# EAGLE design Min_PIC_Trailer (EAGLE 9.6.2)
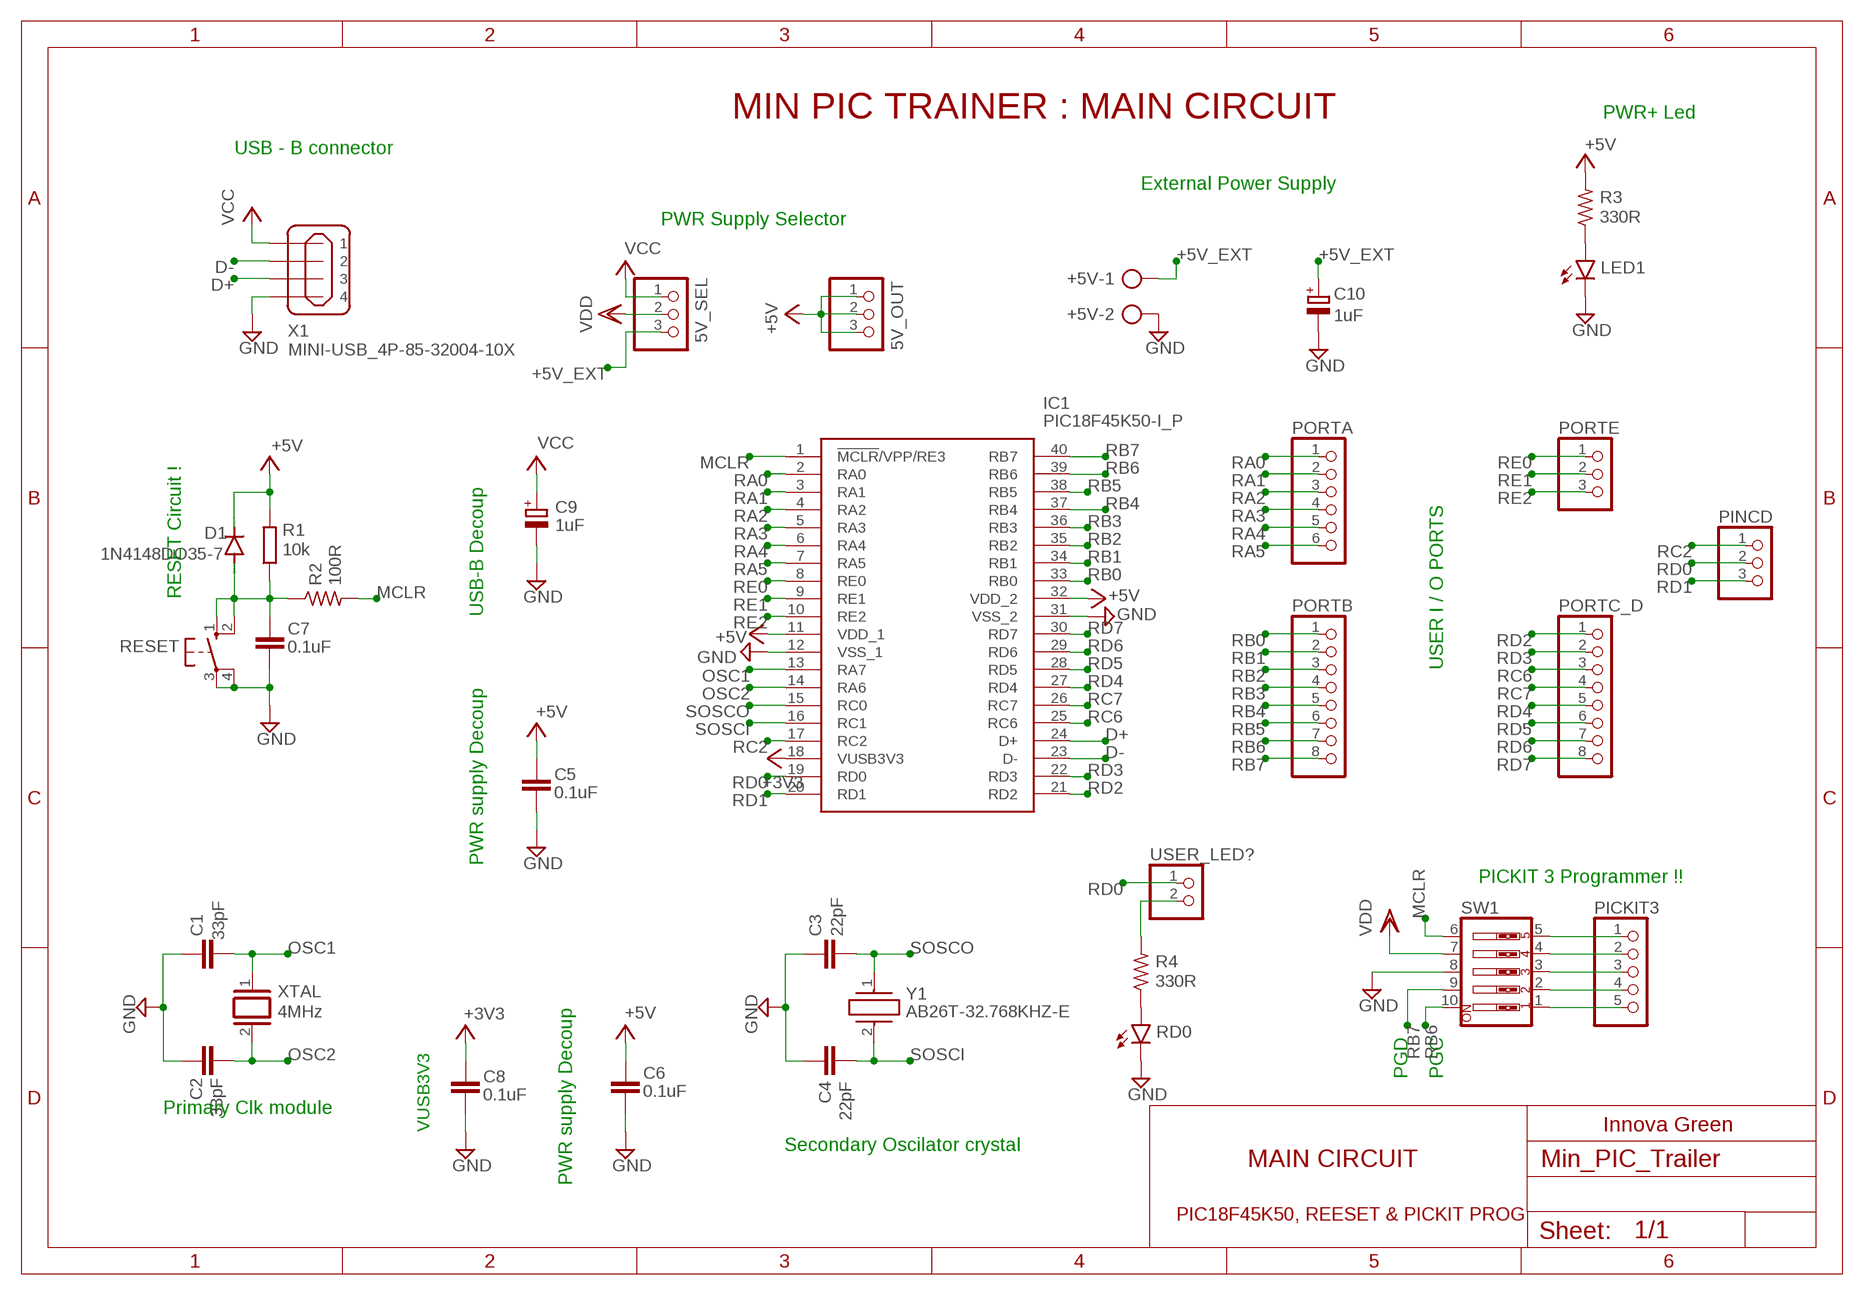
[diagram p0: schematic, sheet 1]

## Parts
5V_OUT  PINHD-1X3  [1X03]
5V_SEL  PINHD-1X3  [1X03]
+5V  AK500/2  [AK500/2]
C1  33pF  C-EUC0805  [C0805]
C2  33pF  C-EUC0805  [C0805]
C3  22pF  C-EUC0805K  [C0805K]
C4  22pF  C-EUC0805K  [C0805K]
C5  0.1uF  C-EUC0805  [C0805]
C6  0.1uF  C-EUC0805  [C0805]
C7  0.1uF  C-EUC0805  [C0805]
C8  0.1uF  C-EUC0805  [C0805]
C9  1uF  CPOL-EUE2.5-6  [E2,5-6]
C10  1uF  CPOL-EUE2.5-6  [E2,5-6]
D1  1N4148DO35-7  [DO35-7]
IC1  PIC18F45K50-I_P  [DIP1543W58P254L5175H635Q40N]
LED1  LEDCHIP-LED0805  [CHIP-LED0805]
PICKIT3  PINHD-1X5/90  [1X05/90]
PINCD  PINHD-1X3  [1X03]
PORTA  PINHD-1X6  [1X06]
PORTB  PINHD-1X8  [1X08]
PORTC_D  PINHD-1X8  [1X08]
PORTE  PINHD-1X3  [1X03]
R1  10k  R-EU_R0805  [R0805]
R2  100R  R-US_R0805W  [R0805W]
R3  330R  R-US_R0805  [R0805]
R4  330R  R-US_R0805  [R0805]
RD0  LEDCHIP-LED0805  [CHIP-LED0805]
RESET  10-XX  [B3F-10XX]
SW1  SW_DIP-5  [EDG-05]
USER_LED?  PINHD-1X2  [1X02]
X1  MINI-USB_4P-85-32004-10X  [85-32004-10X]
XTAL  4MHz  XTAL/S  [QS]
Y1  AB26T-32.768KHZ-E  [AB26T32768KHZE]

## Nets
+3V3: C8.1 IC1.18(VUSB3V3)
+5V: 5V_OUT.1 5V_OUT.2 5V_OUT.3 C5.1 C6.1 D1.C IC1.11(VDD_1) IC1.32(VDD_2) R1.2 R3.2
+5V_EXT: 5V_SEL.3 +5V.1 C10.+
D+: IC1.24(D+) X1.3
D-: IC1.23(D-) X1.2
GND: +5V.2 C1.1 C2.1 C3.1 C4.1 C5.2 C6.2 C7.2 C8.2 C9.- C10.- IC1.12(VSS_1) IC1.31(VSS_2) LED1.C RD0.C RESET.3(P) RESET.4(P1) SW1.8 X1.4
MCLR: IC1.1(!MCLR!/VPP/RE3) R2.2 SW1.6
N$1: C7.1 D1.A R1.1 R2.1 RESET.1(S) RESET.2(S1)
N$2: PICKIT3.1 SW1.5
N$3: PICKIT3.2 SW1.4
N$4: PICKIT3.3 SW1.3
N$5: PICKIT3.4 SW1.2
N$6: PICKIT3.5 SW1.1
N$7: LED1.A R3.1
N$8: R4.1 RD0.A
N$9: R4.2 USER_LED?.2
OSC1: C1.2 IC1.13(RA7) XTAL.1
OSC2: C2.2 IC1.14(RA6) XTAL.2
RA0: IC1.2(RA0) PORTA.1
RA1: IC1.3(RA1) PORTA.2
RA2: IC1.4(RA2) PORTA.3
RA3: IC1.5(RA3) PORTA.4
RA4: IC1.6(RA4) PORTA.5
RA5: IC1.7(RA5) PORTA.6
RB0: IC1.33(RB0) PORTB.1
RB1: IC1.34(RB1) PORTB.2
RB2: IC1.35(RB2) PORTB.3
RB3: IC1.36(RB3) PORTB.4
RB4: IC1.37(RB4) PORTB.5
RB5: IC1.38(RB5) PORTB.6
RB6: IC1.39(RB6) PORTB.7 SW1.10
RB7: IC1.40(RB7) PORTB.8 SW1.9
RC2: IC1.17(RC2) PINCD.1
RC6: IC1.25(RC6) PORTC_D.3
RC7: IC1.26(RC7) PORTC_D.4
RD0: IC1.19(RD0) PINCD.2 USER_LED?.1
RD1: IC1.20(RD1) PINCD.3
RD2: IC1.21(RD2) PORTC_D.1
RD3: IC1.22(RD3) PORTC_D.2
RD4: IC1.27(RD4) PORTC_D.5
RD5: IC1.28(RD5) PORTC_D.6
RD6: IC1.29(RD6) PORTC_D.7
RD7: IC1.30(RD7) PORTC_D.8
RE0: IC1.8(RE0) PORTE.1
RE1: IC1.9(RE1) PORTE.2
RE2: IC1.10(RE2) PORTE.3
SOSCI: C4.2 IC1.16(RC1) Y1.2
SOSCO: C3.2 IC1.15(RC0) Y1.1
VCC: 5V_SEL.1 C9.+ X1.1
VDD: 5V_SEL.2 SW1.7

## Notes on the sheet
- MIN PIC TRAINER : MAIN CIRCUIT | PWR+ Led
- USB - B connector
- External Power Supply
- PWR Supply Selector
- RESET Circuit !
- USB-B Decoup
- USER I / O PORTS
- PWR supply Decoup
- PICKIT 3 Programmer !!
- PGD | PGC
- Primary Clk module
- VUSB3V3 | Innova Green
- Secondary Oscilator crystal
- MAIN CIRCUIT
- PWR supply Decoup
- PIC18F45K50, REESET & PICKIT PROG

## Library data of the parts
5V_OUT 5V_SEL PINCD PORTE = pinhead:PINHD-1X3: PIN HEADER
+5V = con-ptr500:AK500/2: CONNECTOR; OC_FARNELL: unknown; OC_NEWARK: unknown
C1-C8 = rcl:C-EU: CAPACITOR, European symbol; SPICEPREFIX: C
C9 C10 = rcl:CPOL-EU: POLARIZED CAPACITOR, European symbol; SPICEPREFIX: C
D1 = diode:1N4148: DIODE high speed (Philips)
IC1 = SamacSys_Parts:PIC18F45K50-I_P: MCU,PIC18F45K50,48MHz,32KB Flash,PDIP40 Microchip PIC18F45K50-I/P, 8bit PIC Microcontroller, 48MHz, 32 kB Flash, 40-Pin PDIP Source: Datasheet <http://uk.rs-online.com/web/p/products/7863915/>; ARROW_PART_NUMBER: PIC18F45K50-I/P; ARROW_PRICE-STOCK: https://www.arrow.com/en/products/pic18f45k50-ip/microchip-technology; DESCRIPTION: MCU,PIC18F45K50,48MHz,32KB Flash,PDIP40 Microchip PIC18F45K50-I/P, 8bit PIC Microcontroller, 48MHz, 32 kB Flash, 40-Pin PDIP; HEIGHT: 6.35mm; MANUFACTURER_NAME: Microchip; MANUFACTURER_PART_NUMBER: PIC18F45K50-I/P; MOUSER_PART_NUMBER: 579-PIC18F45K50-I/P; MOUSER_PRICE-STOCK: https://www.mouser.co.uk/ProductDetail/Microchip-Technology/PIC18F45K50-I-P?qs=X98pPdo4Mrv32UpFHDgcXA%3D%3D
LED1 RD0 = led:LED: LED OSRAM: - CHIPLED LG R971, LG N971, LY N971, LG Q971, LY Q971, LO R971, LY R971 LH N974, LH R974 LS Q976, LO Q976, LY Q976 LO Q996 - Hyper CHIPLED LW Q18S LB Q993, LB Q99A, LB R99A - SideLED LS A670, LO A670, LY A670, LG A670, LP A670 LB A673, LV A673, LT A673, LW A673 LH A674 LY A675 LS A676, LA A676, LO A676, LY A676, LW A676 LS A679, LY A679, LG A679 - Hyper Micro SIDELED® LS Y876, LA Y876, LO Y876, LY Y876 LT Y87S - SmartLED LW L88C, LW L88S LB L89C, LB L89S, LG L890 LS L89K, LO L89K, LY L89K LS L896, LA L896, LO L896, LY L896 - TOPLED LS T670, LO T670, LY T670, LG T670, LP T670 LSG T670, LSP T670, LSY T670, LOP T670, LYG T670 LG T671, LOG T671, LSG T671 LB T673, LV T673, LT T673, LW T673 LH T674 LS T676, LA T676, LO T676, LY T676, LB T676, LH T676, LSB T676, LW T676 LB T67C, LV T67C, LT T67C, LS T67K, LO T67K, LY T67K, LW E67C LS E67B, LA E67B, LO E67B, LY E67B, LB E67C, LV E67C, LT E67C LW T67C LS T679, LY T679, LG T679 LS T770, LO T770, LY T770, LG T770, LP T770 LB T773, LV T773, LT T773, LW T773 LH T774 LS E675, LA E675, LY E675, LS T675 LS T776, LA T776, LO T776, LY T776, LB T776 LHGB T686 LT T68C, LB T68C - Hyper Mini TOPLED® LB M676 - Mini TOPLED Santana® LG M470 LS M47K, LO M47K, LY M47K Source: http://www.osram.convergy.de LUXEON: - LUMILED® LXK2-PW12-R00, LXK2-PW12-S00, LXK2-PW14-U00, LXK2-PW14-V00 LXK2-PM12-R00, LXK2-PM12-S00, LXK2-PM14-U00 LXK2-PE12-Q00, LXK2-PE12-R00, LXK2-PE12-S00, LXK2-PE14-T00, LXK2-PE14-U00 LXK2-PB12-K00, LXK2-PB12-L00, LXK2-PB12-M00, LXK2-PB14-N00, LXK2-PB14-P00, LXK2-PB14-Q00 LXK2-PR12-L00, LXK2-PR12-M00, LXK2-PR14-Q00, LXK2-PR14-R00 LXK2-PD12-Q00, LXK2-PD12-R00, LXK2-PD12-S00 LXK2-PH12-R00, LXK2-PH12-S00 LXK2-PL12-P00, LXK2-PL12-Q00, LXK2-PL12-R00 Source: www.luxeon.com KINGBRIGHT: KA-3528ASYC Source: www.kingbright.com
PICKIT3 = pinhead:PINHD-1X5: PIN HEADER
PORTA = pinhead:PINHD-1X6: PIN HEADER
PORTB PORTC_D = pinhead:PINHD-1X8: PIN HEADER
R1 = rcl:R-EU_: RESISTOR, European symbol; SPICEPREFIX: R
R2-R4 = rcl:R-US_: RESISTOR, American symbol; SPICEPREFIX: R
RESET = switch-omron:10-XX: OMRON SWITCH; MPN: B3F-1000; OC_FARNELL: 176432; OC_NEWARK: 36M3542
SW1 = special:SW_DIP-5: DIP SWITCH
USER_LED? = pinhead:PINHD-1X2: PIN HEADER
X1 = con-cypressindustries:MINI-USB_4P-: MINI USB 4 Pol. Source: www.cypressindustries.com; OC_FARNELL: unknown; OC_NEWARK: unknown
XTAL = special:XTAL/S: CRYSTAL
Y1 = SamacSys_Parts:AB26T-32.768KHZ-E: Crystals CRYSTAL 32.7680KHZ 12.5PF T/H Source: Datasheet <https://abracon.com/Resonators/AB26T.pdf>; DESCRIPTION: Crystals CRYSTAL 32.7680KHZ 12.5PF T/H; HEIGHT: 8.2mm; MANUFACTURER_NAME: ABRACON; MANUFACTURER_PART_NUMBER: AB26T-32.768KHZ-E; MOUSER_PART_NUMBER: 815-AB26T32.768KHZE; MOUSER_PRICE-STOCK: https://www.mouser.co.uk/ProductDetail/ABRACON/AB26T-32.768KHZ-E?qs=wnTfsH77Xs4HTj7FfHFZLQ%3D%3D

## Board
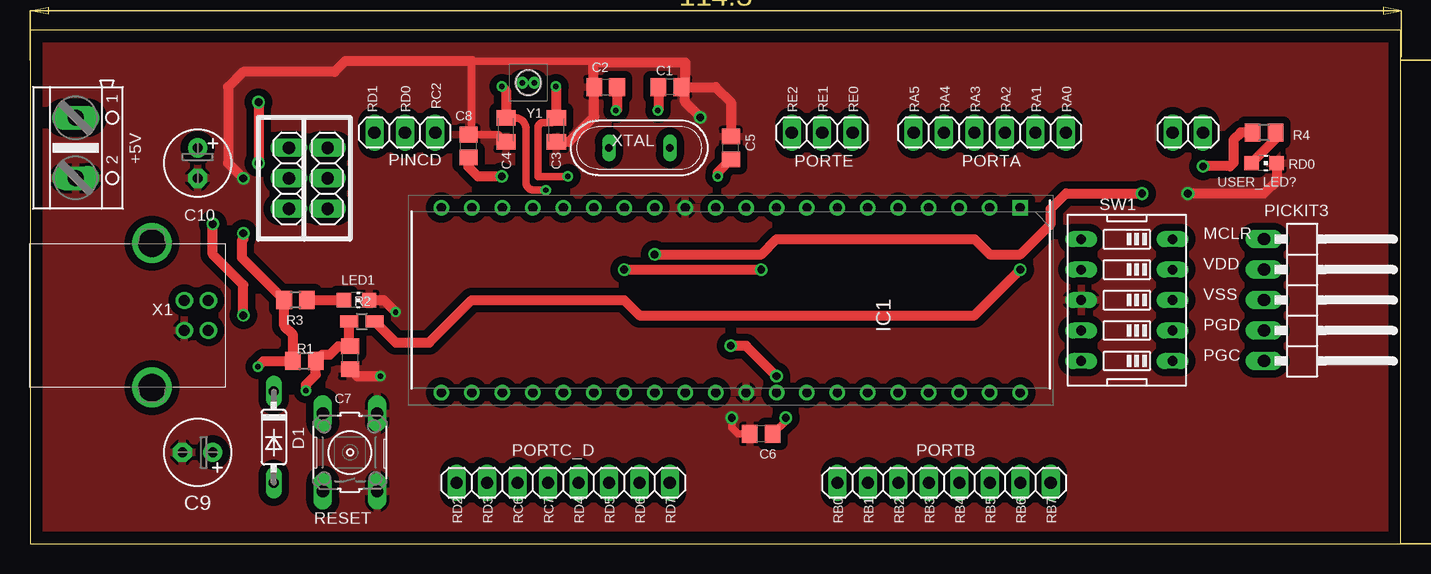
[diagram p1: board, top side]
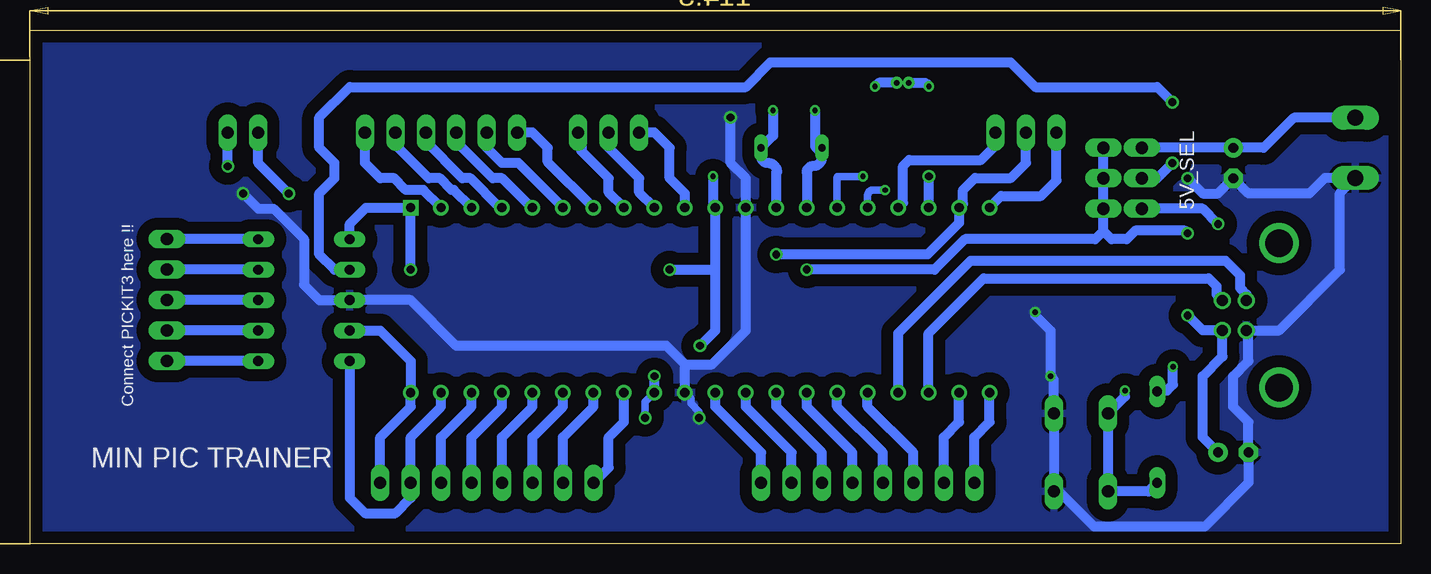
[diagram p2: board, bottom side, seen from below]

Size 114.28 x 42.85 mm. Coordinates in mm from the lower left corner, seen from the top.
Outline: 0,0 114.28,0 114.28,42.85 0,42.85 0,0
Copper layers (1*16): Top 0.035mm / dielectric 1.5mm / Bottom 0.035mm
Design rules "default": minimum track width 6mil, minimum drill 0.35mm, track to track 6mil, track to pad 6mil, pad to pad 6mil, via to via 6mil, smd to smd 6mil, copper to edge 40mil, drill to drill 6mil, minimum pad ring 10mil, minimum via ring 8mil, stop-mask expansion 4mil, vias tented up to drill 0mil, thermal gap 10mil
Milling: area 0,44.2 to 1.5,44.8; area 112.8,44.2 to 114.3,44.8; area 53.7,44.9 to 60.6,46.6; area 117.8,38.8 to 118.4,40.3; area 117.8,0 to 118.4,1.5; area 118.5,16.7 to 120.3,23.6; 6 lines

### Footprints (pad centres in the part's own frame; a part is rotated, then mirrored left to right if it is on the bottom)
1X03 = drill 1.016 long: 1 -2.54,0; 2 0,0; 3 2.54,0
AK500/2 = drill 1.321 long: 1 -2.515,0; 2 2.515,0
C0805 = smd 1.3 x 1.5: 1 -0.95,0; 2 0.95,0
C0805K = smd 1.3 x 1.6: 1 -1,0; 2 1,0
E2,5-6 = drill 0.813 pad 1.6: + -1.27,0 | drill 0.813 pad 1.6 octagon: - 1.27,0
DO35-7 = drill 0.813 long: A 3.81,0; C -3.81,0
DIP1543W58P254L5175H635Q40N = drill 0.784 pad 1.184 square: 1 -7.715,24.13 | drill 0.784 pad 1.184: 2 -7.715,21.59; 3 -7.715,19.05; 4 -7.715,16.51; 5 -7.715,13.97; 6 -7.715,11.43; 7 -7.715,8.89; 8 -7.715,6.35; 9 -7.715,3.81; 10 -7.715,1.27; 11 -7.715,-1.27; 12 -7.715,-3.81; 13 -7.715,-6.35; 14 -7.715,-8.89; 15 -7.715,-11.43; 16 -7.715,-13.97; 17 -7.715,-16.51; 18 -7.715,-19.05; 19 -7.715,-21.59; 20 -7.715,-24.13; 21 7.715,-24.13; 22 7.715,-21.59; 23 7.715,-19.05; 24 7.715,-16.51; 25 7.715,-13.97; 26 7.715,-11.43; 27 7.715,-8.89; 28 7.715,-6.35; 29 7.715,-3.81; 30 7.715,-1.27; 31 7.715,1.27; 32 7.715,3.81; 33 7.715,6.35; 34 7.715,8.89; 35 7.715,11.43; 36 7.715,13.97; 37 7.715,16.51; 38 7.715,19.05; 39 7.715,21.59; 40 7.715,24.13
CHIP-LED0805 = smd 1.2 x 1.2: A 0,-1.05; C 0,1.05
1X05/90 = drill 1.016 long: 1 -5.08,-3.81; 2 -2.54,-3.81; 3 0,-3.81; 4 2.54,-3.81; 5 5.08,-3.81
1X06 = drill 1.016 long: 1 -6.35,0; 2 -3.81,0; 3 -1.27,0; 4 1.27,0; 5 3.81,0; 6 6.35,0
1X08 = drill 1.016 long: 1 -8.89,0; 2 -6.35,0; 3 -3.81,0; 4 -1.27,0; 5 1.27,0; 6 3.81,0; 7 6.35,0; 8 8.89,0
R0805 = smd 1.3 x 1.5: 1 -0.95,0; 2 0.95,0
R0805W = smd 1.5 x 1: 1 -1.052,0; 2 1.052,0
B3F-10XX = drill 1.016 long: 1 -3.251,2.261; 2 3.251,2.261; 3 -3.251,-2.261; 4 3.251,-2.261
EDG-05 = drill 0.813 long: 1 -5.08,-3.81; 2 -2.54,-3.81; 3 0,-3.81; 4 2.54,-3.81; 5 5.08,-3.81; 6 5.08,3.81; 7 2.54,3.81; 8 0,3.81; 9 -2.54,3.81; 10 -5.08,3.81
1X02 = drill 1.016 long: 1 -1.27,0; 2 1.27,0
85-32004-10X = drill 0.92 pad 1.27: 1 4.71,-1.25; 2 4.71,1.25; 3 2.71,1.25; 4 2.71,-1.25 | drill 2.3 pad 3: M1 0,6.02; M2 0,-6.02
QS = drill 0.61 long: 1 -2.54,0; 2 2.54,0
AB26T32768KHZE = drill 0.46 pad 0.7: 1 0,0; 2 1,0

### Placement (x,y rotation side)
5V_OUT  24.8,30.48 90 top
5V_SEL  21.59,30.48 90 top
+5V  3.81,33.02 270 top
C1  53.34,38.1 180 top
C2  47.99,38.1 0 top
C3  43.87,34.52 90 top
C4  39.68,34.52 90 top
C5  58.42,33.02 90 top
C6  60.96,9.16 180 top
C7  26.67,15.51 270 top
C8  36.56,33.17 90 top
C9  13.97,7.62 180 top
C10  13.97,31.75 270 top
D1  20.32,8.89 270 top
IC1  58.42,20.32 270 top
LED1  27.22,20.32 270 top
PICKIT3  106.68,20.32 270 top
PINCD  31.25,34.29 180 top
PORTA  80.01,34.29 180 top
PORTB  76.2,5.08 0 top
PORTC_D  44.45,5.08 0 top
PORTE  66.04,34.29 180 top
R1  22.88,15.23 180 top
R2  27.66,18.54 0 top
R3  22.14,20.32 180 top
R4  102.87,34.29 180 top
RD0  102.87,31.75 270 top
RESET  26.67,7.62 90 top
SW1  91.44,20.32 90 top
USER_LED?  96.52,34.29 0 top
X1  10.16,19.05 0 top
XTAL  50.8,33.02 180 top
Y1  42.04,38.45 180 top

### Tracks (layer width: path | path; a pad name or v marks a point on that pad's centre or on a via)
+3V3  (via drill 0.65)
  Top 0.813: C8.1 36.56,31.42 37.34,30.64 v39.34,30.64
  Bottom 0.813: 39.37,30.61 arc90 v39.34,30.64 39.37,30.61 | 39.37,30.61 IC1.18
+5V  (via drill 0.45, 0.65)
  Top 0.61: C6.1 63,10.25 v63,10.5
  Top 0.813: C5.1 57.34,30.99 v57.34,30.64 | v19,14.77 19.46,15.23 R1.2 21.93,17.44 21.19,18.18 R3.2 17.65,23.86 17.65,25.27 17.78,25.4 v17.78,25.9 | v62.23,13.97 59.69,16.51 v58.42,16.51 | v49.53,22.86 v60.96,22.86
  Bottom 0.61: IC1.32 63,11.84 v63,10.5
  Bottom 0.813: D1.C 20.25,12.77 19.5,12.77 19,13.27 v19,14.77 | v57.34,30.64 57.34,28.23 arc-90 IC1.11 57.15,22.86 | v17.78,25.9 18,26.12 22.14,26.12 22.86,25.4 24.13,25.4 24.8,26.07 | 24.8,26.07 5V_OUT.1 5V_OUT.2 5V_OUT.3 | IC1.32 v62.23,13.97 | v58.42,16.51 57.15,17.78 57.15,22.86 | 24.8,26.07 25.47,25.4 36.33,25.4 38.87,22.86 v49.53,22.86 | v60.96,22.86 57.15,22.86
+5V_EXT
  Bottom 0.813: +5V.1 8.91,35.53 11.43,33.02 C10.+ 5V_SEL.3
D+
  Bottom 0.813: X1.3 12.87,20.8 13.4,21.34 13.4,22.39 14.61,23.59 35.87,23.59 41.91,17.55 IC1.24
D-
  Bottom 0.813: IC1.23 39.37,17.55 34.79,22.13 16.01,22.13 15.37,21.49 15.37,20.8 X1.2
GND  (via drill 0.45, 0.65)
  Top 0.61: C4.1 39.08,34.12 C8.2 36.83,34.39 36.83,40.26 46.89,40.26 46.99,40.16 | v58.5,10.5 58.5,9.67 59.01,9.16 C6.2
  Top 0.813: v29.21,13.97 27.26,13.97 C7.2 | LED1.C 29.48,20.32 v30.48,19.32 | C1.1 54.61,38.1 | 54.61,38.1 57.15,38.1 58.42,36.83 C5.2 | C3.1 44.95,33.52 47.04,35.61 C2.1 46.99,38.1 46.99,40.16 54.61,40.16 54.61,38.1 | 36.83,40.26 26.29,40.26 25.4,39.37 17.78,39.37 16.51,38.1 16.51,31.75 v17.78,30.48 | RD0.C 103.92,30.26 102.87,29.21 v96.52,29.21 | v55.88,35.56 54.61,36.83 54.61,38.1
  Bottom 0.61: v58.5,10.5 58.5,11 59.19,11.69 59.19,12.11 IC1.31
  Bottom 0.813: v30.48,19.32 30.48,19.05 29.21,17.78 v29.21,13.97 28.93,13.69 RESET.4 RESET.3 28.5,4.37 25.55,1.42 16.36,1.42 12.7,5.08 C9.- 12.7,10.16 13.97,11.43 13.97,13.97 12.7,15.24 12.7,17.63 X1.4 10.14,17.8 5.08,22.86 5.08,29.23 +5V.2 6.33,30.5 7.62,29.21 12.7,29.21 C10.- 15.24,29.21 16.51,29.21 v17.78,30.48 | 59.69,14.97 61.23,16.51 78.74,16.51 82.55,20.32 SW1.8 90.17,20.32 91.44,21.59 91.44,25.4 93.98,27.94 95.25,27.94 v96.52,29.21 | IC1.31 59.69,14.97 | 59.69,14.97 57.42,14.97 54.61,17.78 IC1.12 54.61,30.48 55.88,31.75 v55.88,35.56
  pour Top (isolate 0.61): 0,0 114.3,0 114.3,43.18 0,43.18
  pour Bottom (isolate 1.016): 0,0 114.3,0 114.3,43.18 0,43.18
MCLR  (via drill 0.65)
  Top 0.813: R2.2 30.48,16.77 33.28,16.77 36.83,20.32 49.53,20.32 50.8,19.05 78.74,19.05 v82.55,22.86
  Bottom 0.813: SW1.6 87.63,26.67 86.27,28.04 IC1.1 v82.55,22.86
N$1  (via drill 0.45)
  Top 0.813: R2.1 26.61,16.52 C7.1 25.69,16.46 25,15.77 24.37,15.77 R1.1 23.83,14.1 23,13.27 v23,12.77
  Bottom 0.813: D1.A 21.03,4.37 RESET.1 RESET.2 23,12.28 v23,12.77
N$2
  Bottom 0.813: SW1.5 PICKIT3.1
N$3
  Bottom 0.813: SW1.4 PICKIT3.2
N$4
  Bottom 0.813: SW1.3 PICKIT3.3
N$5
  Bottom 0.813: SW1.2 PICKIT3.4
N$6
  Bottom 0.813: SW1.1 PICKIT3.5
N$7
  Top 0.813: R3.1 LED1.A
N$8
  Top 0.813: RD0.A 103.82,33.75 R4.1
N$9  (via drill 0.65)
  Top 0.813: R4.2 100.92,34.29 100.33,33.7 100.33,31.75 100.06,31.48 v97.79,31.48
  Bottom 0.813: v97.79,31.48 USER_LED?.2
OSC1  (via drill 0.45)
  Top 0.813: C1.2 52.39,36.14 v52.34,36.14
  Bottom 0.813: v52.34,36.14 52.34,34.02 XTAL.1 53.34,32.34 arc-90 52.75,31.75 arc90 52,31 arc-90 52.07,30.93 IC1.13
OSC2  (via drill 0.45)
  Top 0.813: C2.2 48.94,36.24 v48.84,36.14
  Bottom 0.813: v48.84,36.14 48.84,33.14 48.49,32.79 XTAL.2 48.26,32.24 arc90 49,31.5 arc-90 49.53,30.97 IC1.14
RA0
  Bottom 0.813: IC1.2 81.49,29.52 82.95,29.52 83.92,30.48 85.09,30.48 86.36,31.75 PORTA.1
RA1
  Bottom 0.813: IC1.3 78.95,29.52 79.14,29.52 80.11,30.48 81.05,30.48 83.82,33.25 PORTA.2
RA2
  Bottom 0.813: IC1.4 75.12,28.04 77.56,30.48 78.24,30.48 81.28,33.52 PORTA.3
RA3
  Bottom 0.813: IC1.5 72.48,28.04 74.93,30.48 75.7,30.48 78.74,33.52 PORTA.4
RA4
  Bottom 0.813: IC1.6 73.56,31.75 74.93,31.75 76.2,33.02 PORTA.5
RA5
  Bottom 0.813: IC1.7 71.12,31.84 71.12,33.02 72.39,34.29 PORTA.6
RB0
  Bottom 0.813: PORTB.1 66.04,6.35 66.04,8.89 64.77,10.16 IC1.33
RB1
  Bottom 0.813: PORTB.2 69.85,8.89 67.31,11.43 IC1.34
RB2
  Bottom 0.813: PORTB.3 72.39,8.89 69.85,11.43 IC1.35
RB3
  Bottom 0.813: PORTB.4 74.93,8.89 72.39,11.43 IC1.36
RB4
  Bottom 0.813: PORTB.5 77.47,8.89 74.93,11.43 IC1.37
RB5
  Bottom 0.813: PORTB.6 80.01,8.89 77.47,11.43 IC1.38
RB6
  Bottom 0.813: IC1.39 80.01,11.43 82.55,8.89 PORTB.7 82.55,3.81 83.82,2.54 86.36,2.54 87.63,3.81 SW1.10
RB7
  Bottom 0.813: PORTB.8 85.09,8.89 82.55,11.43 IC1.40 82.55,15.24 85.09,17.78 SW1.9
RC2
  Bottom 0.813: IC1.17 41.5,28.45 41.5,31.5 41,32 35,32 33.79,33.21 PINCD.1
RC6
  Bottom 0.813: PORTC_D.3 40.64,7.62 44.45,11.43 IC1.25
RC7
  Bottom 0.813: PORTC_D.4 43.18,7.62 46.99,11.43 IC1.26
RD0  (via drill 0.65)
  Top 0.813: v92.71,29.21 86.36,29.21 85.09,27.94 85.09,26.67 82.55,24.13 80.01,24.13 78.74,25.4 62.23,25.4 60.96,24.13 v52.07,24.13
  Bottom 0.813: v52.07,24.13 39.47,24.13 36.83,26.77 IC1.19 36.5,28.36 36.5,29.5 35.5,30.5 32.5,30.5 31.25,31.75 PINCD.2 | v92.71,29.21 95.25,31.75 USER_LED?.1
RD1
  Bottom 0.813: IC1.20 33.33,29 30,29 28.71,30.29 PINCD.3
RD2
  Bottom 0.813: PORTC_D.1 35.56,8.89 34.29,10.16 IC1.21
RD3
  Bottom 0.813: PORTC_D.2 38.1,8.89 36.83,10.16 IC1.22
RD4
  Bottom 0.813: PORTC_D.5 45.72,7.62 49.53,11.43 IC1.27
RD5
  Bottom 0.813: PORTC_D.6 48.26,7.62 52.07,11.43 IC1.28
RD6
  Bottom 0.813: PORTC_D.7 50.8,7.62 54.61,11.43 IC1.29
RD7
  Bottom 0.813: PORTC_D.8 53.34,7.62 57.15,11.43 IC1.30
RE0
  Bottom 0.813: IC1.8 66.04,29.3 66.04,30.48 68.31,32.75 68.31,34.02 PORTE.1
RE1
  Bottom 0.813: IC1.9 63.5,29.3 63.5,30.48 66.04,33.02 PORTE.2
RE2
  Bottom 0.813: IC1.10 59.69,29.21 60.96,30.48 60.96,33.02 62.23,34.29 PORTE.3
SOSCI  (via drill 0.45)
  Top 0.61: C4.2 40.46,35.52 arc-90 41.34,34.64 41.34,30.16 arc90 42,29.5 v43,29.5
  Top 0.813: v39.34,38.14 39.68,37.8 C4.2
  Bottom 0.61: v43,29.5 44,29.5 arc-90 44.45,29.05 IC1.16
  Bottom 0.813: Y1.2 39.65,38.45 v39.34,38.14
SOSCO  (via drill 0.45)
  Top 0.61: v44.84,30.64 42.34,30.64 42.34,34.64 arc-90 42.84,35.14 43.49,35.14 arc90 C3.2
  Top 0.813: v43.84,38.14 43.87,38.11 C3.2
  Bottom 0.61: v44.84,30.64 46.86,30.64 arc-90 47,30.5 IC1.15 arc-90 IC1.15
  Bottom 0.813: Y1.1 43.53,38.45 v43.84,38.14
VCC  (via drill 0.65)
  Top 0.813: v15.24,26.67 15.24,24.13 17.78,21.59 v17.78,19.05
  Bottom 0.813: C9.+ 16.51,8.89 16.51,13.97 14.87,15.61 X1.1 16.53,17.8 v17.78,19.05 | v15.24,26.67 16.51,27.94 5V_SEL.1
VDD  (via drill 0.65)
  Top 0.813: v19.05,36.83 v19.05,31.75
  Bottom 0.813: SW1.7 88.9,22.86 90.17,24.13 90.17,29.21 88.9,30.48 88.9,31.75 90.17,33.02 90.17,35.56 87.63,38.1 54.61,38.1 52.55,40.16 32.54,40.16 30.48,38.1 20.32,38.1 v19.05,36.83 | v19.05,31.75 20.32,30.48 5V_SEL.2

### Text on the board
bPlace: Connect PICKIT3 here !! | MIN PIC TRAINER
tNames: RD1 | RD0 | RC2 | RE2 | RE1 | RE0 | RA5 | RA4 | RA3 | RA2 | RA1 | RA0 | MCLR | VDD | VSS | PGD | PGC | RD2 | RD3 | RC6 | RC7 | RD4 | RD5 | RD6 | RD7 | RB0 | RB1 | RB2 | RB3 | RB4 | RB5 | RB6 | RB7
tDocu: X1-1: 5V | VUSB | VPICKIT | X1-2: GND | VEXT | +5V External Only !! | MIN PIC TRAINER
bDocu: +5V External Only !! | PSWR SEL: USB, EXT, PICKIT | for Innova Green | by S. Candiotti